# Altium schematic sheet TB-S5D5_p02_Power-v1.2.SchDoc: Renesas AE-CAP1-S3 Target Board
size Legal; Author: Jorge Amodio; Organization: Serious Integrated, Inc.; Address1: 145 s 79th Street; Address2: Suite 34; Address3: Chandler, AZ 85226; Address4: USA; DocumentNumber: 2; Revision: PCB02; SheetNumber: 2; SheetTotal: 5; CompanyURL: www.seriousintegrated.com; ReleaseDate: 8/12/2016; Version: v1.1; Company Name: Renesas Electronics America; PageSetup: Record=PageOptions|CenterHorizontal=True|CenterVertical=True|PrintScale=1.00|XCorrection=1.00|YCorrection=1.00|PrintKind=1|BorderSize=5000000|LeftOffset=0|BottomOffset=0|Orientation=2|PaperLength=1000|PaperWidth=1000|Scale=100|PaperSource=7|PrintQuality=-4|MediaType=1|DitherType=10|PaperKind=A5 148x210mm|PrintScaleMode=1
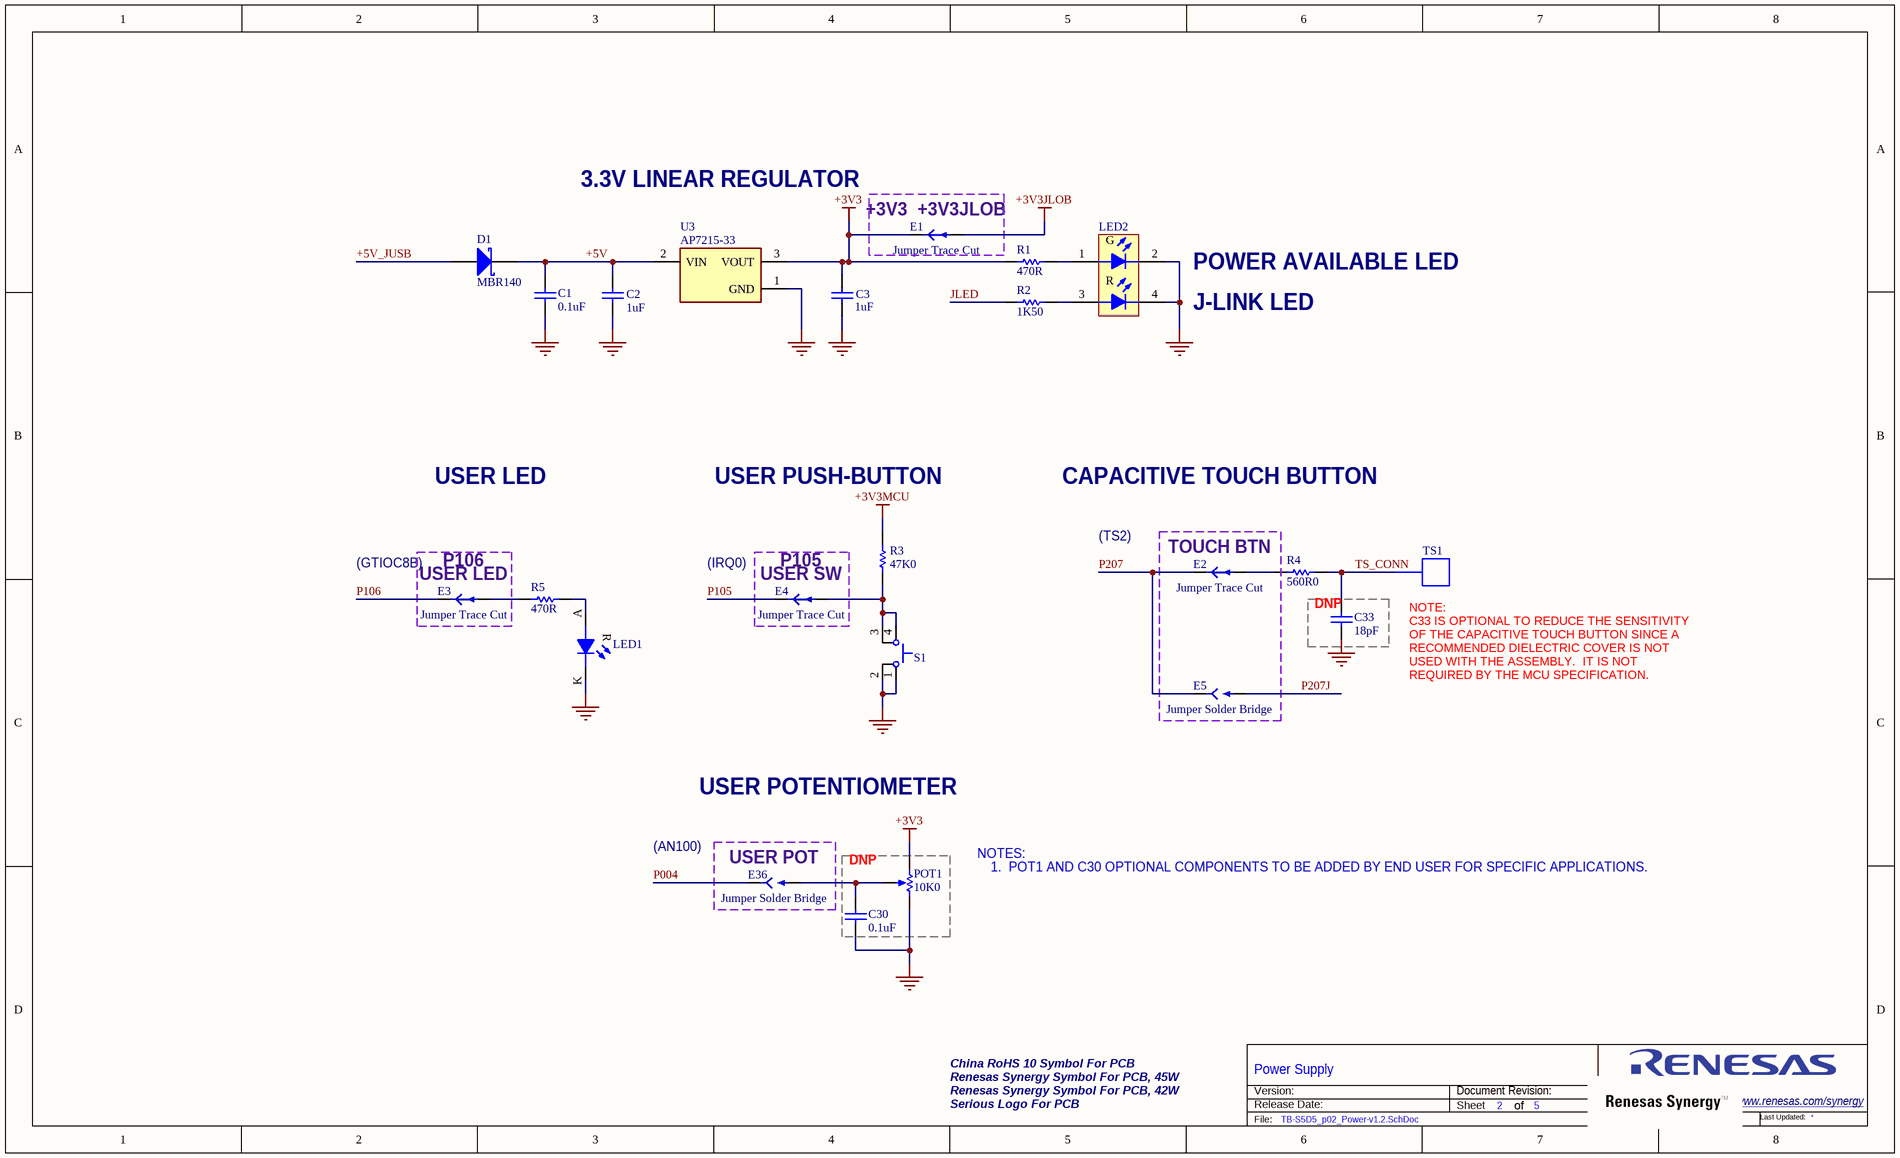
[diagram p0: TB-S5D5_p02_Power-v1.2.SchDoc]

## Parts
A_Logo1  This BOM is for Engineering Use Only, NOT FOR PURCHASE USE.  [_SeriousEngineering]  (value not drawn)
A_Symbol1  This Symbol Placed on PCB only.  [ChinaRoHS-7mm]  (value not drawn)  (no BOM)
A_Symbol2  This Symbol Placed on PCB only.  [RenesasSynergyLogo45x7]  (value not drawn)  (no BOM)
A_Symbol3  This Symbol Placed on PCB only.  [RenesasSynergyLogo42x7]  (value not drawn)  (no BOM)
C1  Capacitance: 0.1uF  [CAPC0603-01]  (hidden comment: CAP-000029-01)
C2  Capacitance: 1uF  [CAPC0402-01]  (hidden comment: CAP-000063-01)
C3  Capacitance: 1uF  [CAPC0402-01]  (hidden comment: CAP-000063-01)
C30  Capacitance: 0.1uF  [CAPC0603-01]  (hidden comment: CAP-000029-01)
C33  Capacitance: 18pF  [CAPC0603-01]  (hidden comment: CAP-000040-01)
D1  Display Name: MBR140  [ONSEMI_SOD-123LF]  (hidden comment: DIO-000012-01)
E1  Jumper Trace Cut  [E_PadsTraceCut0805]  (net tie, no BOM)
E2  Jumper Trace Cut  [E_PadsTraceCut0805]  (net tie, no BOM)
E3  Jumper Trace Cut  [E_PadsTraceCut0805]  (net tie, no BOM)
E4  Jumper Trace Cut  [E_PadsTraceCut0805]  (net tie, no BOM)
E5  Jumper Solder Bridge  [E_PadsSplit0805]  (no BOM)
E36  Jumper Solder Bridge  [E_PadsSplit0805]  (no BOM)
LED1  LED-000005-01  [LED_0603-RED]  (value not drawn)
LED2  LED-000001-01  [LED_DIALIGHT-598-8610]  (value not drawn)
POT1  Resistance: 10K0  [BOURNS_3352T]  (hidden comment: POT-000001-02)
R1  Resistance: 470R  [RESC0402-01]  (hidden comment: RES-000124-01)
R2  Resistance: 1K50  [RESC0402-01]  (hidden comment: RES-000140-01)
R3  Resistance: 47K0  [RESC0402-01]  (hidden comment: RES-000173-01)
R4  Resistance: 560R0  [RESC0603-01]  (hidden comment: RES-000206-01)
R5  Resistance: 470R  [RESC0402-01]  (hidden comment: RES-000124-01)
S1  SWT-000013-01  [SW_C&K_PTS645_43]  (value not drawn)
TS1  TOUCH_PAD_OL  [RENESAS_TSP_OL]  (value not drawn)  (no BOM)
U3  Display Name: AP7215-33  [SOT-89-3]  (hidden comment: ICN-000215-01)

## Blocks framed on the sheet
+3V3  +3V3JLOB: E1
TOUCH BTN: E2 E5
DNP: C33
USER POT: E36
DNP: C30 POT1

## Nets
+3V3: C3.2 E1.1(A) POT1.1 R1.1 U3.3(VOUT)
+3V3JLOB: E1.2(A)
+3V3MCU: R3.2
GND: C1.1 C2.1 C3.1 C30.1 C33.1 LED1.K LED2.2(K1) LED2.4(K2) POT1.3 S1.1 S1.2 U3.1(GND)
+5V: C1.2 C2.2 D1.K U3.2(VIN)
+5V_JUSB: D1.A
JLED: R2.1
P004: E36.1(A)
P105: E4.1(A)
P106: E3.1(A)
P207: E2.1(A) E5.1(A)
P207J: E5.2(A)
TS_CONN: C33.2 R4.2
NetC30_2: C30.2 E36.2(A) POT1.2
NetE2_2: E2.2(A) R4.1
NetE3_2: E3.2(A) R5.2
NetE4_2: E4.2(A) R3.1 S1.3 S1.4
NetLED1_A: LED1.A R5.1
NetLED2_1: LED2.1(A1) R1.2
NetLED2_3: LED2.3(A2) R2.2

## Notes on the sheet
- 3.3V LINEAR REGULATOR
- POWER AVAILABLE LED
- J-LINK LED
- USER LED
- USER PUSH-BUTTON
- CAPACITIVE TOUCH BUTTON
- (near E3) (GTIOC8B)
- (near E3) P106
- (near E4) (IRQ0)
- (near E4) P105
- (TS2)
- (near E3) USER LED
- (near E4) USER SW
- NOTE:
  C33 IS OPTIONAL TO REDUCE THE SENSITIVITY OF THE CAPACITIVE TOUCH BUTTON SINCE A RECOMMENDED DIELECTRIC COVER IS NOT USED WITH THE ASSEMBLY.  IT IS NOT REQUIRED BY THE MCU SPECIFICATION.
- USER POTENTIOMETER
- (AN100)
- NOTES:
- 1.  POT1 AND C30 OPTIONAL COMPONENTS TO BE ADDED BY END USER FOR SPECIFIC APPLICATIONS.
- Power Supply
- Version:
- Release Date:
- Document Revision:
- Sheet
- of
- www.renesas.com/synergy <http://www.renesas.com/synergy>
- File:
- 60
- Last Updated:
- (in symbol A_Serious_Engineering_Logo) Serious Logo For PCB
- (in symbol A_Symbol_ChinaRoHS07) China RoHS 10 Symbol For PCB
- (in symbol A_Symbol_RenesasSynergy-42x7) Renesas Synergy Symbol For PCB, 42W
- (in symbol A_Symbol_RenesasSynergy-45x7) Renesas Synergy Symbol For PCB, 45W
- (in symbol LED-000001-01) G; R
- (in symbol LED-000005-01) R

## Library data of the parts
A_Logo1 = A_Serious_Engineering_Logo: Combination disclaimer and Serious Integrated Design splash; Mfg Part Number: (none); Manufacturer: N/A
A_Symbol1 = A_Symbol_ChinaRoHS07: China RoHs Symbol Circle-7
A_Symbol2 = A_Symbol_RenesasSynergy-45x7: Renesas Synergy Logo, Std 45Wx7.4Hmm
A_Symbol3 = A_Symbol_RenesasSynergy-42x7: Renesas Synergy Logo, 42Wx6.8Hmm
C1 C30 = CAP-000029-01: Ceramic Chip Capacitor 0603 0.1uF 50V; Manufacturer: Samsung; Mfg Part Number: CL10B104KB8NNNC; Dialectric: X7R; Tolerance: 10%; Voltage: 50V; Package: 0603
C2 C3 = CAP-000063-01: Ceramic Chip Capacitor 0402 1uF 16V; Manufacturer: Samsung; Mfg Part Number: CL05A105KO5NNNC; Dialectric: X5R; Tolerance: 10%; Voltage: 16V; Package: 0402
C33 = CAP-000040-01: Ceramic Chip Capacitor 0603 18pF 50V; Manufacturer: Samsung; Mfg Part Number: CL10C180JB8NNNC; Dialectric: COG; Tolerance: 5%; Voltage: 50V; Package: 0603
D1 = DIO-000012-01: OnSemi Schottky Power Rectifier 40V 1A; Mfg Part Number: MBR140SFT1G; Manufacturer: OnSemi; Package: SOD-123FL; Voltage: 40V; Current: 1A
E1-E4 = E_JmpTraceCut: Pads on PCB with Trace Between for Cutting to isolate
E5 E36 = E_JmpSldrBridge: Pads on PCB with Narrow Gap to allow Solder Bridging
LED1 = LED-000005-01: Lite-On LED Red Clear 0603; Mfg Part Number: LTST-C191KRKT; Manufacturer: Lite-On; Package: 0603
LED2 = LED-000001-01: Dialight Bicolor LED Red/Green 1210; Mfg Part Number: 598-8610-207F; Manufacturer: Dialight; Package: 1210
POT1 = POT-000001-02: Bourns Single Turn Trimmer 10K0; Mfg Part Number: 3352T-1-103LF; Tolerance: 20%; Package: BOURNS_3355T; Manufacturer: Bourns
R1 R5 = RES-000124-01: Chip Resistor Thick Film 0402 470R 0.5% 1/16W; Manufacturer: Panasonic; Mfg Part Number: ERA-2AED471X; Package: 0402; Power: 1/16W; Tolerance: 0.5%
R2 = RES-000140-01: Chip Resistor Thick Film 0402 1K50 0.5% 1/16W; Manufacturer: Panasonic; Mfg Part Number: ERA-2AED152X; Package: 0402; Power: 1/16W; Tolerance: 0.5%
R3 = RES-000173-01: Chip Resistor Thick Film 0402 47K0 1% 1/10W; Manufacturer: Panasonic; Mfg Part Number: ERJ-2RKF4702X; Package: 0402; Power: 1/10W; Tolerance: 1%
R4 = RES-000206-01: Chip Resistor Thick Film 0603 560R0 1% 1/10W; Manufacturer: Panasonic; Mfg Part Number: ERJ-3EKF5600V; Package: 0603; Power: 1/10W; Tolerance: 1%; Serious P/N: RES-000206-01
S1 = SWT-000013-01: Push Button Switch 6 x 6mm 4.3mm High; Manufacturer: C&K; Mfg Part Number: PTS645SM43SMTR92 LFS; Serious P/N: SWT-000013-01
TS1 = TOUCH_PAD_OL: Renesas Touch Sense Pad Outline (for non-Pad use)
U3 = ICN-000215-01: LDO Regulator 3.3V 600mA; Manufacturer: Diodes; Mfg Part Number: AP7215-33YG-13; Package: SOT-89-3